# EAGLE schematic BlinkyMobil (EAGLE 9.2.2)
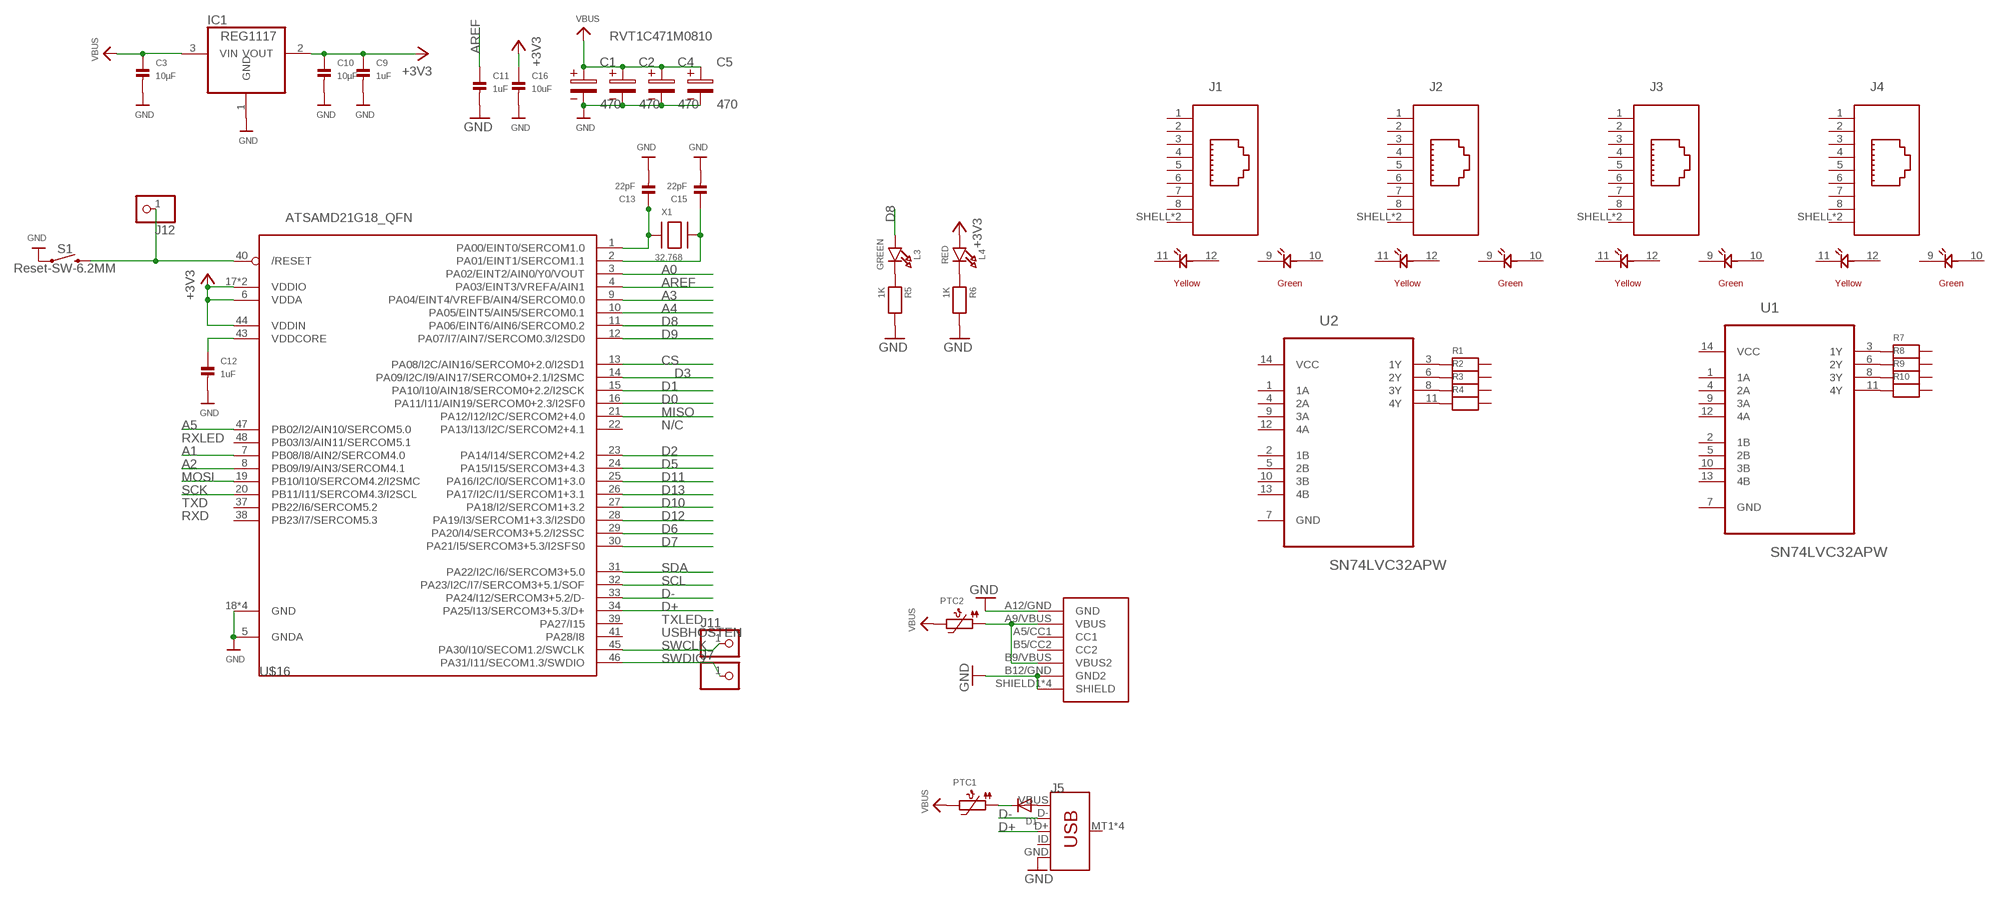
[diagram p0: schematic, sheet 1]

## Parts
C1  470  WCAP-ASLU_8X6,5_865090149007  [4.2X1.9X2.8(BXCXA)]
C2  470  WCAP-ASLU_8X6,5_865090149007  [4.2X1.9X2.8(BXCXA)]
C3  10µF  CAP_CERAMIC0805  [0805]
C4  470  WCAP-ASLU_8X6,5_865090149007  [4.2X1.9X2.8(BXCXA)]
C5  470  WCAP-ASLU_8X6,5_865090149007  [4.2X1.9X2.8(BXCXA)]
C9  1uF  CAP_CERAMIC0603  [0603]
C10  10µF  CAP_CERAMIC0805  [0805]
C11  1uF  CAP_CERAMIC0603  [0603]
C12  1uF  CAP_CERAMIC0603  [0603]
C13  22pF  CAP_CERAMIC0603  [0603]
C15  22pF  CAP_CERAMIC0603  [0603]
C16  10uF  CAP_CERAMIC0805  [0805]
D1  DIODESMA  [SMADIODE]
IC1  REG1117  [SOT223]
J1  615008137421  [615008137421]
J2  615008137421  [615008137421]
J3  615008137421  [615008137421]
J4  615008137421  [615008137421]
J5  USB_MICRO-B_SMT  [USB-MICROB]
J7  PINHD-1X1  [1X01]
J11  PINHD-1X1  [1X01]
J12  PINHD-1X1  [1X01]
L3  GREEN  LED0805_NOOUTLINE  [CHIPLED_0805_NOOUTLINE]
L4  RED  LED0805_NOOUTLINE  [CHIPLED_0805_NOOUTLINE]
PTC1  PTC1812  [PTC1812]
PTC2  PTC1812  [PTC1812]
R1  RESISTOR0805  [0805]
R2  RESISTOR0805  [0805]
R3  RESISTOR0805  [0805]
R4  RESISTOR0805  [0805]
R5  1K  RESISTOR0603  [0603]
R6  1K  RESISTOR0603  [0603]
R7  RESISTOR0805  [0805]
R8  RESISTOR0805  [0805]
R9  RESISTOR0805  [0805]
R10  RESISTOR0805  [0805]
S1  Reset-SW-6.2MM  MOMENTARY-SWITCH-SPST-SMD-6.2MM-TALL  [TACTILE_SWITCH_SMD_6.2MM_TALL]
U1  SN74LVC32APW  [SOP65P640X120-14N]
U2  SN74LVC32APW  [SOP65P640X120-14N]
U$4  USB-C-TYPE-C-31-M-17  [USB-C-TYPE-C-31-M-17]
U$16  ATSAMD21G18_QFN  ATSAMD21J_QFN  [TQFN48_7MM]
X1  32.768  XTAL-3.2X1.5  [XTAL3215]

## Nets
+3V3: C9.1 C10.1 C16.1 IC1.2(VOUT) L4.A U$16.6(VDDA) U$16.17(VDDIO) U$16.36(VDDIO) U$16.44(VDDIN)
A0: U$16.3(PA02/EINT2/AIN0/Y0/VOUT)
A1: U$16.7(PB08/I8/AIN2/SERCOM4.0)
A2: U$16.8(PB09/I9/AIN3/SERCOM4.1)
A3: U$16.9(PA04/EINT4/VREFB/AIN4/SERCOM0.0)
A4: U$16.10(PA05/EINT5/AIN5/SERCOM0.1)
A5: U$16.47(PB02/I2/AIN10/SERCOM5.0)
AREF: C11.1 U$16.4(PA03/EINT3/VREFA/AIN1)
CS: U$16.13(PA08/I2C/AIN16/SERCOM0+2.0/I2SD1)
D0: U$16.16(PA11/I11/AIN19/SERCOM0+2.3/I2SF0)
D1: U$16.15(PA10/I10/AIN18/SERCOM0+2.2/I2SCK)
D2: U$16.23(PA14/I14/SERCOM2+4.2)
D3: U$16.14(PA09/I2C/I9/AIN17/SERCOM0+2.1/I2SMC)
D5: U$16.24(PA15/I15/SERCOM3+4.3)
D6: U$16.29(PA20/I4/SERCOM3+5.2/I2SSC)
D7: U$16.30(PA21/I5/SERCOM3+5.3/I2SFS0)
D8: L3.A U$16.11(PA06/EINT6/AIN6/SERCOM0.2)
D9: U$16.12(PA07/I7/AIN7/SERCOM0.3/I2SD0)
D10: U$16.27(PA18/I2/SERCOM1+3.2)
D11: U$16.25(PA16/I2C/I0/SERCOM1+3.0)
D12: U$16.28(PA19/I3/SERCOM1+3.3/I2SD0)
D13: U$16.26(PA17/I2C/I1/SERCOM1+3.1)
D+: J5.D+ U$16.34(PA25/I13/SERCOM3+5.3/D+)
D-: J5.D- U$16.33(PA24/I12/SERCOM3+5.2/D-)
GND: C1.2 C2.2 C3.2 C4.2 C5.2 C9.2 C10.2 C11.2 C12.2 C13.2 C15.2 C16.2 IC1.1(GND) J5.GND R5.2 R6.2 S1.A2 U$4.A12/GND(GND) U$4.B12/GND(GND2) U$4.SHIELD1(SHIELD) U$4.SHIELD2(SHIELD) U$4.SHIELD3(SHIELD) U$4.SHIELD4(SHIELD) U$16.5(GNDA) U$16.18(GND) U$16.35(GND) U$16.42(GND) U$16.THERMAL(GND)
MISO: U$16.21(PA12/I12/I2C/SERCOM2+4.0)
MOSI: U$16.19(PB10/I10/SERCOM4.2/I2SMC)
N$1: J12.1 S1.B2 U$16.40(/RESET)
N$2: C13.1 U$16.1(PA00/EINT0/SERCOM1.0) X1.P$1
N$3: C15.1 U$16.2(PA01/EINT1/SERCOM1.1) X1.P$2
N$4: L3.C R5.1
N$5: D1.A J5.VBUS
N$6: R1.1 U2.3(1Y)
N$7: R2.1 U2.6(2Y)
N$8: L4.C R6.1
N$9: R3.1 U2.8(3Y)
N$10: R4.1 U2.11(4Y)
N$11: R7.1 U1.3(1Y)
N$12: R8.1 U1.6(2Y)
N$13: R9.1 U1.8(3Y)
N$14: R10.1 U1.11(4Y)
N$15: PTC2.P$1 U$4.A9/VBUS(VBUS) U$4.B9/VBUS(VBUS2)
N$16: D1.C PTC1.P$1
SCK: U$16.20(PB11/I11/SERCOM4.3/I2SCL)
SCL: U$16.32(PA23/I2C/I7/SERCOM3+5.1/SOF)
SDA: U$16.31(PA22/I2C/I6/SERCOM3+5.0)
SWCLK: J11.1 U$16.45(PA30/I10/SECOM1.2/SWCLK)
SWDIO: J7.1 U$16.46(PA31/I11/SECOM1.3/SWDIO)
VBUS: C1.1 C2.1 C3.1 C4.1 C5.1 IC1.3(VIN) PTC1.P$2 PTC2.P$2
VDDCORE1: C12.1 U$16.43(VDDCORE)
Unconnected: J1.1 J1.2 J1.3 J1.4 J1.5 J1.6 J1.7 J1.8 J1.9 J1.10 J1.11 J1.12 J1.SHELL1(SHIELD) J1.SHELL(SHIELD) J2.1 J2.2 J2.3 J2.4 J2.5 J2.6 J2.7 J2.8 J2.9 J2.10 J2.11 J2.12 J2.SHELL1(SHIELD) J2.SHELL(SHIELD) J3.1 J3.2 J3.3 J3.4 J3.5 J3.6 J3.7 J3.8 J3.9 J3.10 J3.11 J3.12 J3.SHELL1(SHIELD) J3.SHELL(SHIELD) J4.1 J4.2 J4.3 J4.4 J4.5 J4.6 J4.7 J4.8 J4.9 J4.10 J4.11 J4.12 J4.SHELL1(SHIELD) J4.SHELL(SHIELD) J5.ID J5.MT1(SHIELD) J5.MT2(SHIELD) J5.P$1(SHIELD) J5.P$2(SHIELD) R1.2 R2.2 R3.2 R4.2 R7.2 R8.2 R9.2 R10.2 U1.1(1A) U1.2(1B) U1.4(2A) U1.5(2B) U1.7(GND) U1.9(3A) U1.10(3B) U1.12(4A) U1.13(4B) U2.1(1A) U2.2(1B) U2.4(2A) U2.5(2B) U2.7(GND) U2.9(3A) U2.10(3B) U2.12(4A) U2.13(4B) U$4.A5/CC1(CC1) U$4.B5/CC2(CC2) U$16.22(PA13/I13/I2C/SERCOM2+4.1) U$16.37(PB22/I6/SERCOM5.2) U$16.38(PB23/I7/SERCOM5.3) U$16.39(PA27/I15) U$16.41(PA28/I8) U$16.48(PB03/I3/AIN11/SERCOM5.1)

## Notes on the sheet
- RVT1C471M0810
- N/C
- RXLED
- TXD
- RXD
- TXLED
- USBHOSTEN

## Power pins joined to a net without a drawn wire
VCC: U1.14(VCC) U2.14(VCC)

## Library data of the parts
C1 C2 C4 C5 = Wurth_Elektronik_Passive_Capacitors_rev18b:WCAP-ASLU: WCAP-ASLU Aluminum Electrolytic Capacitors Characteristics Aluminum Electrolytic Capacitor Recommended soldering: Reflow Operating temperature: -40 °C to +85 °C low leakage current product series Load life:1000 h @ +85 °C Package name and Variant abbreviation: Package: Package: B X C X A = length of the solder pad X width of the solder pad X pitch of the solder pad. <http://katalog.we-online.de/media/images/eisos/WCAP-ASLU_pf2.jpg> Details see: http://katalog.we-online.de/en/pbs/WCAP-ASLU?m Updated by: Yingchun,Shan Updated: 2017-03-16 2017 (C) Wurth Elektronik; WE-NUMBER: 865090149007/220uF
C3 C9-C13 C15 C16 = microbuilder:CAP_CERAMIC: Ceramic Capacitors 0402 - 0402 Surface Mount Capacitors 16pF 50V 5% [Digikey: 445-4899-2-ND] 18pF 50V 5% [Digikey: 490-1281-2-ND] 22pF 50V 5% [Digikey: 490-1283-2-ND] 68pF 50V 5% [Digikey: 490-1289-2-ND] 0.1uF 10V 10% [Digikey: 490-1318-2-ND] 1.0uF 6.3V 10% [Digikey: 490-1320-2-ND] 0603 - 0603 Surface Mount Capacitors 16 pF 50V 5% [Digikey: 445-5051-2-ND] 22 pF 50V [Digikey: PCC220ACVTR-ND] 33 pF 50V 5% [Digikey: 490-1415-1-ND] 56pF 50V 5% [Digikey: 490-1421-1-ND] 220pF 50V 5% [Digikey: 445-1285-1-ND] 680 pF 50V 2200 pF 50V 5% C0G [Digikey: 445-1297-1-ND] 5600 pF 100V 5% X7R [Digikey: 478-3711-1-ND] 0.1 µF 25V 10% [Digikey: PCC2277TR-ND] 0.22 µF 16V 10% X7R [Digikey: 445-1318-1-ND] 1.0 µF 25V 10% [Digikey: 445-5146-2-ND] 0603 - RF Specific 3pF 250V +/-0.1pF RF [Digikey: 712-1347-1-ND] 18 pF 250V 5% [Digikey: 478-3505-1-ND or 712-1322-1-ND] 56 pF 250V 5% C0G RF [Digikey: 490-4867-1-ND] 68 pF 250V RF [Digikey: 490-4868-1-ND] 0805 - 0805 Surface Mount Capacitors 220 pF 250V 2% RF Ceramic Capacitor [Digikey: 712-1398-1-ND] 1000 pF 50V 2% NP0 Ceramic Capacitor [Digikey: 478-3760-1-ND] 0.1 µF 25V 10% Ceramic Capacitor [Digikey: PCC1828TR-ND] 1.0 µF 16V 10% Ceramic Capacitor[Digikey: 490-1691-2-ND] 10.0 µF 10V 10% Ceramic Capacitor[Digikey: 709-1228-1-ND] 10.0 uF 16V 10% Ceramic Capacitor [Digikey: 478-5165-2-ND] 47 uF 6.3V 20% Ceramic Capacitor [Digikey: 587-1779-1-ND or 399-5506-1-ND] 1206 - 1206 Surface Mount Capacitors 47uF 10V 20% Ceramic Capacitor [Digikey: 490-5528-1-ND or 399-5508-1-ND or 445-6010-1-ND] 100uF 6.3V -20%, +80% Y5V Ceramic Capacitor (Digikey: 490-4512-1-ND, Mouser: 81-GRM31CF50J107ZE1L)
D1 = microbuilder:DIODE: Diode SMA Model Volts Amps Type Vf Vr Digikey # Notes SSA34-E3 40V 3A Schottky 480mV @ 3A 200uA @ 40V SSA34-E3/61TGITR-ND CDBA120-G 20V 1A Schottky 500mV @ 1A 500uA @ 20V 641-1014-6-ND REEL MBRA210 10V 2A Schottky 350mV @ 2A 700uA @ 10V MBRA210LT3 SOD-123 Model Volts Amps Type Vf Vr Order # Notes BAT54T1G 30V 200mA Schottky 800mV @ 200mA 2uA @ 25V BAT54T1GOSTR-ND B0530W 30V 500mA Schottky 430mV @ 500mA 130uA @ 30V B0530W-FDICT-ND REEL MBR120 1A 20V Schottky 340mV @ 1A MBR120VLSFT1GOSCT-ND SOD-323 Model Volts Amps Type Vf Vr Order # Notes PMEG2005EJ 20V 500mA Schottky 355mV @ 500mA 568-4110-1-ND ZLLS410 10V 570mA Schottky 380mV @ 570mA ZLLS410CT-ND 1N4148WS 75V 150mA Silicon/Simple 1V 1N4148WSFSCT-ND REEL SOD-523 Model Volts Amps Type Vf Vr Order # Notes BAT54XV2 30V 200mA Schottky 0.8V @ 100mA BAT54XV2CT-ND TB751S 30V 30mA Schottky RB751S-40TE61CT-ND SOT23-R/W (R = Solder Paste/Reflow Ovens, W = Hand-Soldering) Model Volts Amps Type Vf Vr Order # Notes BAT54FILM 40V 300mA Schottky 497-7162-1-ND
IC1 = burr-brown:REG1117: 800mA and 1A Low Dropout (LDO) Positive Regulator 1.8V, 2.5V, 2.85V, 3.3V, 5V, and Adj; MPN: REG1117; OC_FARNELL: 1097566; OC_NEWARK: 14P6981
J1-J4 = EAGLE-INPUT_OUTPUT_CONNECTORS-rev17a:615008137421: WR-MJ Modular Jack Horizontal Shielded with LED & EMI Panel Finger, 8 Pins=>Code : thb_615008137421 <http://katalog.we-online.de/media/thumbs2/eican/thb_615008137421_pf2.jpg> Details see: http://katalog.we-online.de/en/em/MJ_HORIZONTAL_SHIELDED_W_LED_AND_EMI_PANEL_FINGER_8P8C_TAB_UP Created 2014-07-10, Karrer Zheng 2014 (C) Würth Elektronik
J5 = SparkFun-Connectors:USB_MICRO-B: USB Type Micro-B Connector Male/female and PTH/SMT variants SparkFun Products: SparkFun microB USB Breakout <https://www.sparkfun.com/products/12035> SparkFun USB microB Plug Breakout <https://www.sparkfun.com/products/10031> SparkFun ESP8266 Thing <https://www.sparkfun.com/products/13231>; PROD_ID: CONN-09505; SF_ID: PRT-08533
J7 J11 J12 = adafruit:PINHD-1X1: Pin header 1x1 for 0.1" spacing With round pins
L3 L4 = microbuilder:LED: LED 0603 - 0603 Surface Mount Package 2mA: Green LED - Low Power (3.9mcd, 2ma, 1.7Vf) - Digikey: 475-2709-2-ND Orange LED - Low Power (9.8mcd, 2ma, 1.8Vf) - Digikey: 475-1194-2-ND Red LED - Low Power (5mcd, 2ma, 1.8Vf) - Digikey: 475-1195-2-ND Yellow LED - Low Power (7mcd, 2ma, 1.8Vf) - Digikey: 475-1196-2-ND 5mA: Blue LED - Low Power (17mcd, 5ma, 2.9Vf) - Digikey: LNJ937W8CRACT-ND 0805 - 0805 Surface Mount Package 2mA: Red LED (8.8mcd, 2mA, 1.8Vf, Clear) - Low Power [Digikey: 475-2510-1-ND] Green LED (5mcd, 2mA, 1.8Vf, Clear) - Low Power [Digikey: 475-2730-1-ND] Yellow LED (11.3mcd, 2mA, 1.8Vf, Clear) - Low Power [Digikey: 475-2555-1-ND] 20mA: Red LED (104mcd, 20mA, Diffused) - LS R976 [Digikey: 475-1278-6-ND] Red LED (12mcd, 20mA, 2.0Vf, Clear) - APT2012EC [Digikey: 754-1128-1-ND] Green LED (15mcd, 20mA, 2.2Vf, Clear) - APT2012GC [Digikey: 754-1131-1-ND] Orange LED (160mcd, 20mA, 2.1Vf, Clear) - APT2012SECK [Digikey: 754-1130-1-ND] 1206 - 1206 Surface Mount Package Green LED (26mcd, 20mA, Diffused) - LG N971 [Digikey: 475-1407-6-ND] Red LED (15mcd, 20mA, Diffused) - LH N974 [Digikey: 475-1416-6-ND] Cree - Cree High-Power Surface Mount LEDs XPEBWT-L1-0000-00D50 - White 111lm 350mA 2.9Vf 6200K 110° XTEAWT-00-0000-00000LEE3 - White 114lm 350mA 2.85Vf 5000K 115° Everlight - Everlight 45-21 Series Surface Mount LEDs 45-21/QK2C-B2832AC2CB2/2T - Warm White 2000mcd 20mA 3.25Vf 3050K 120° 45-21/LK2C-B38452C4CB2/2T - Nuetral White 2000mcd 20mA 3.25Vf 4150K 120° 45-21/LK2C-B50634C6CB2/2T - Cold White 2200mcd 20mA 3.25Vf 5650K 120° PLCC2 Reverse Mount LS T77K-J1L2-1-0-2-R18-Z - Red 11.25mcd 2mA 1.8Vf 630nm 120° LO T77K-L1M2-24-Z - Orange 19.6mcd 2mA 1.8Vf 606nm 120° LY T77K-K2M1-26-Z - Yellow 15.7mcd 2mA 1.8Vf 587nm 120°
PTC1 PTC2 = microbuilder:PTC: PTC (Resettable Fuse) 1206 Package 250mA PTC (16V Max, Time-to-Trip: 0.08s) - Digikey: F2110CT-ND 1210 Package 100mA PTC (30V Max, Time-to-Trip: 0.6s) - Digikey: MF-USMF010-2CT-ND 1812 Package 750mA PTC (24V Max, Time-to-Trip: 0.2s) - Digikey: MF-MSMF075/24-2CT-ND
R1-R10 = microbuilder:RESISTOR: Resistors 0402 - 0402 Surface Mount Package 22 Ohm 1% 1/16W [Digikey: 311-22.0LRTR-ND] 33 Ohm 5% 1/16W 1.0K 5% 1/16W 1.5K 5% 1/16W 2.0K 1% 1/16W 10.0K 1% 1/16W [Digikey: 311-10.0KLRTR-ND] 10.0K 5% 1/16W [Digikey: RMCF0402JT10K0TR-ND] 12.1K 1% 1/16W [Digikey: 311-22.0LRTR-ND] 100.0K 5% 1/16W 0603 - 0603 Surface Mount Package 0 Ohm 1/10 Watt 1% Resistor 15 Ohm 1/10 Watt 1% Resistor 33 Ohm 1/10 Watt 1% Resistor 49.9 Ohm 1/10 Watt 1% Resistor 100 Ohm 1/10 Watt 1% Resistor 150 Ohm 1/10 Watt 1% Resistor 240 Ohm 1/10 Watt 1% Resistor 390 Ohm 1/10 Watt 1% Resistor 560 Ohm 1/10 Watt 1% Resistor 680 Ohm 1/10 Watt 1% Resistor 750 Ohm 1/10 Watt 1% Resistor 1.0K Ohm 1/10 Watt 1% Resistor 1.5K Ohm 1/10 Watt 1% Resistor 2.0K Ohm 1/10 Watt 1% Resistor 2.2K Ohm 1/10 Watt 1% Resistor 3.3K Ohm 1/10 Watt 1% Resistor 4.7K Ohm 1/10 Watt 1% Resistor 10.0K Ohm 1/10 Watt 1% Resistor 12.0K Ohm 1/10 Watt 1% Resistor 12.1K Ohm 1/10 Watt 1% Resistor 20.0K Ohm 1/10 Watt 1% Resistor 33.0K Ohm 1/10 Watt 1% Resistor 100.0K Ohm 1/10 Watt 1% Resistor 0805 - 0805 Surface Mount Package 0 Ohm 1/8 Watt 1% Resistor 33 Ohm 1/8 Watt 1% Resistor 100 Ohm 1/8 Watt 1% Resistor 150 Ohm 1/8 Watt 1% Resistor 200 Ohm 1/8 Watt 1% Resistor 240 Ohm 1/8 Watt 1% Resistor 330 Ohm 1/8 Watt 1% Resistor 390 Ohm 1/8 Watt 1% Resistor 470 Ohm 1/8 Watt 1% Resistor 1.0K Ohm 1/8 Watt 1% Resistor 1.5K Ohm 1/8 Watt 1% Resistor 2.0K Ohm 1/8 Watt 1% Resistor 4.7K Ohm 1/8 Watt 1% Resistor 5.1K Ohm 1/8 Watt 1% Resistor 5.6K Ohm 1/8 Watt 1% Resistor 10.0K Ohm 1/8 Watt 1% Resistor 22.0K Ohm 1/8 Watt 1% Resistor 33.0K Ohm 1/8 Watt 1% Resistor 100K Ohm 1/8 Watt 1% Resistor 1206 - 1206 Surface Mount Package 2012 - 2010 Surface Mount Package 0.11 Ohm 1/2 Watt 1% Resistor - Digikey: RHM.11UCT-ND
S1 = SparkFun-Switches:MOMENTARY-SWITCH-SPST: Momentary Switch (Pushbutton) - SPST Normally-open (NO) SPST momentary switches (buttons, pushbuttons). Variants PTH-12MM - 12mm square, through-hole Momentary Pushbutton Switch - 12mm Square <https://www.sparkfun.com/products/9190> (COM-09190) PTH-6.0MM, PTH-6.0MM-KIT - 6.0mm square, through-hole Mini Pushbutton Switch <https://www.sparkfun.com/products/97> (COM-00097) KIT package intended for soldering kit's - only one side of pads' copper is exposed. PTH-RIGHT-ANGLE-KIT - Right-angle, through-hole Right Angle Tactile Button <https://www.sparkfun.com/products/10791> - Used on SparkFun BigTime Watch Kit <https://www.sparkfun.com/products/11734> SMD-12MM - 12mm square, surface-mount Tactile Button - SMD (12mm) <https://www.sparkfun.com/products/12993> (COM-12993) Used on SparkFun PicoBoard <https://www.sparkfun.com/products/11888> SMD-4.5MM - 4.5mm Square Trackball Switch Used on SparkFun Blackberry Trackballer Breakout <https://www.sparkfun.com/products/13169> SMD-4.6MMX2.8MM - 4.60mm x 2.80mm, surface mount Used on SparkFun SAMD21 Mini Breakout <https://www.sparkfun.com/products/13664> SMD-5.2MM, SMD-5.2-REDUNDANT - 5.2mm square, surface-mount Mini Pushbutton Switch - SMD <https://www.sparkfun.com/products/8720> (COM-08720) Used on Arduino Pro Mini <https://www.sparkfun.com/products/11114> REDUNDANT package connects both switch circuits together SMD-6.0X3.5MM - 6.0 x 3.5mm, surface mount Momentary Reset Switch SMD <https://www.sparkfun.com/products/8229> (COM-08229) SMD-6.2MM-TALL - 6.2mm square, surface mount Tactile Button - SMD (6mm) <https://www.sparkfun.com/products/12992> Used on SparkFun Digital Sandbox <https://www.sparkfun.com/products/12651> SMD-RIGHT-ANGLE - Right-angle, surface mount Used on SparkFun Block for Intel® Edison - Arduino <https://www.sparkfun.com/products/13036>; PROD_ID: SWCH-11966; SF_SKU: COM-12992
U1 U2 = Texas Instruments:SN74LVC32APW: QUADRUPLE FET BUS SWITCH 2.5-V/3.3-V LOW-VOLTAGE BUS SWITCH WITH 5-V-TOLERANT LEVEL SHIFTER; MPN: SN74LVC32APW; OC_FARNELL: 1740050; OC_NEWARK: 34R8954; PACKAGE: TSSOP-14; SUPPLIER: Texas Instruments
U$4 = timon-diverses:USB-C-TYPE-C-31-M-17
U$16 = microbuilder:ATSAMD21J
X1 = adafruit2:XTAL: Low cost SMT crystals, no capacitors included http://www.ladyada.net/library/eagle